# EAGLE design receiver-2x (EAGLE 7.2.0)
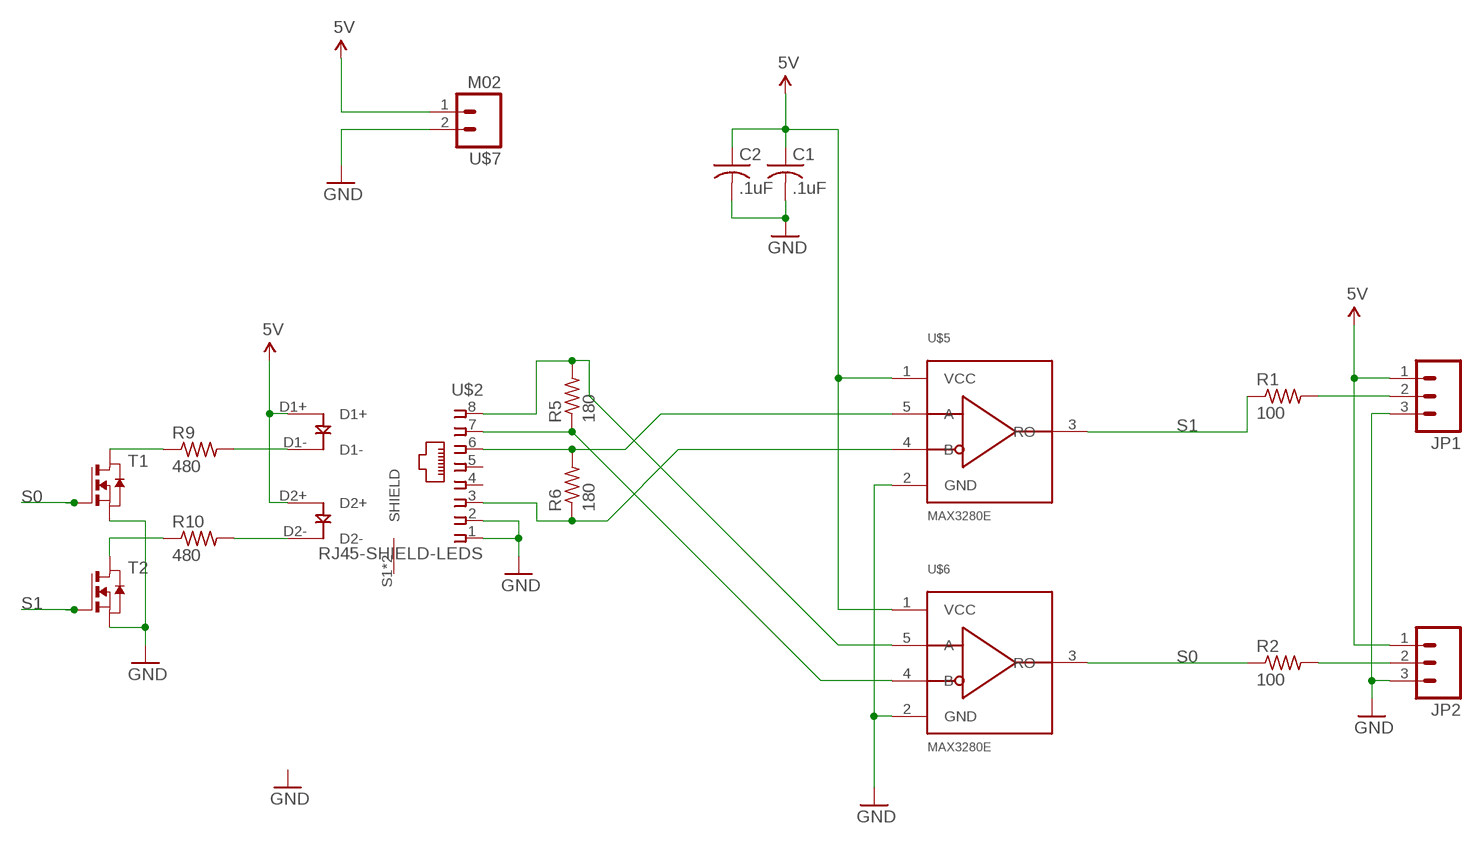
[diagram p0: schematic, sheet 1]

## Parts
C1  .1uF  C-USC0603  [C0603]
C2  .1uF  C-USC0603  [C0603]
JP1  M03SCREW-DETACH  [SCREWTERMINAL-5MM-3-DETACHABLE]
JP2  M03SCREW-DETACH  [SCREWTERMINAL-5MM-3-DETACHABLE]
R1  100  R-US_R0603  [R0603]
R2  100  R-US_R0603  [R0603]
R5  180  R-US_R0603  [R0603]
R6  180  R-US_R0603  [R0603]
R9  480  R-US_R0603  [R0603]
R10  480  R-US_R0603  [R0603]
T1  NMOSSOT23  [SOT-23]
T2  NMOSSOT23  [SOT-23]
U$2  RJ45-SHIELD-LEDS  [RJ45-SHIELD-LEDS-ALT]
U$5  MAX3280E  [SOT23-5L]
U$6  MAX3280E  [SOT23-5L]
U$7  M02  [SCREWTERMINAL-5MM-2-DETACHABLE]

## Nets
5V: C1.1 C2.1 JP1.1 JP2.1 U$2.D1+ U$2.D2+ U$5.1(VCC) U$6.1(VCC) U$7.1
GND: C1.2 C2.2 JP1.3 JP2.3 T1.2(S) T2.2(S) U$2.1 U$2.2 U$5.2(GND) U$6.2(GND) U$7.2
N$1: JP1.2 R1.2
N$4: JP2.2 R2.2
N$5: R10.2 U$2.D2-
N$6: R9.2 U$2.D1-
N$7: R10.1 T2.1(D)
N$10: R9.1 T1.1(D)
S0: R2.1 T1.3(G) U$6.3(RO)
S0_IN+: R5.2 U$2.8 U$6.5(A)
S0_IN-: R5.1 U$2.7 U$6.4(B)
S1: R1.1 T2.3(G) U$5.3(RO)
S1_IN+: R6.2 U$2.6 U$5.5(A)
S1_IN-: R6.1 U$2.3 U$5.4(B)
Unconnected: U$2.4 U$2.5 U$2.S1(SHIELD) U$2.S2(SHIELD)

## Library data of the parts
C1 C2 = adafruit:C-US: CAPACITOR, American symbol
JP1 JP2 = LEDscape:M03: Header 3 Standard 3-pin 0.1" header. Use with straight break away headers (SKU : PRT-00116), right angle break away headers (PRT-00553), swiss pins (PRT-00743), machine pins (PRT-00117), and female headers (PRT-00115). Molex polarized connector foot print use with SKU : PRT-08232 with associated crimp pins and housings.
R1 R2 R5 R6 R9 R10 = adafruit:R-US_: RESISTOR, American symbol
T1 T2 = zetex:NMOSSOT23: MOS FET; OC_FARNELL: unknown; OC_NEWARK: unknown
U$2 = LEDscape:RJ45-SHIELD-LEDS
U$5 U$6 = LEDscape:MAX3280E
U$7 = LEDscape:M02

## Board
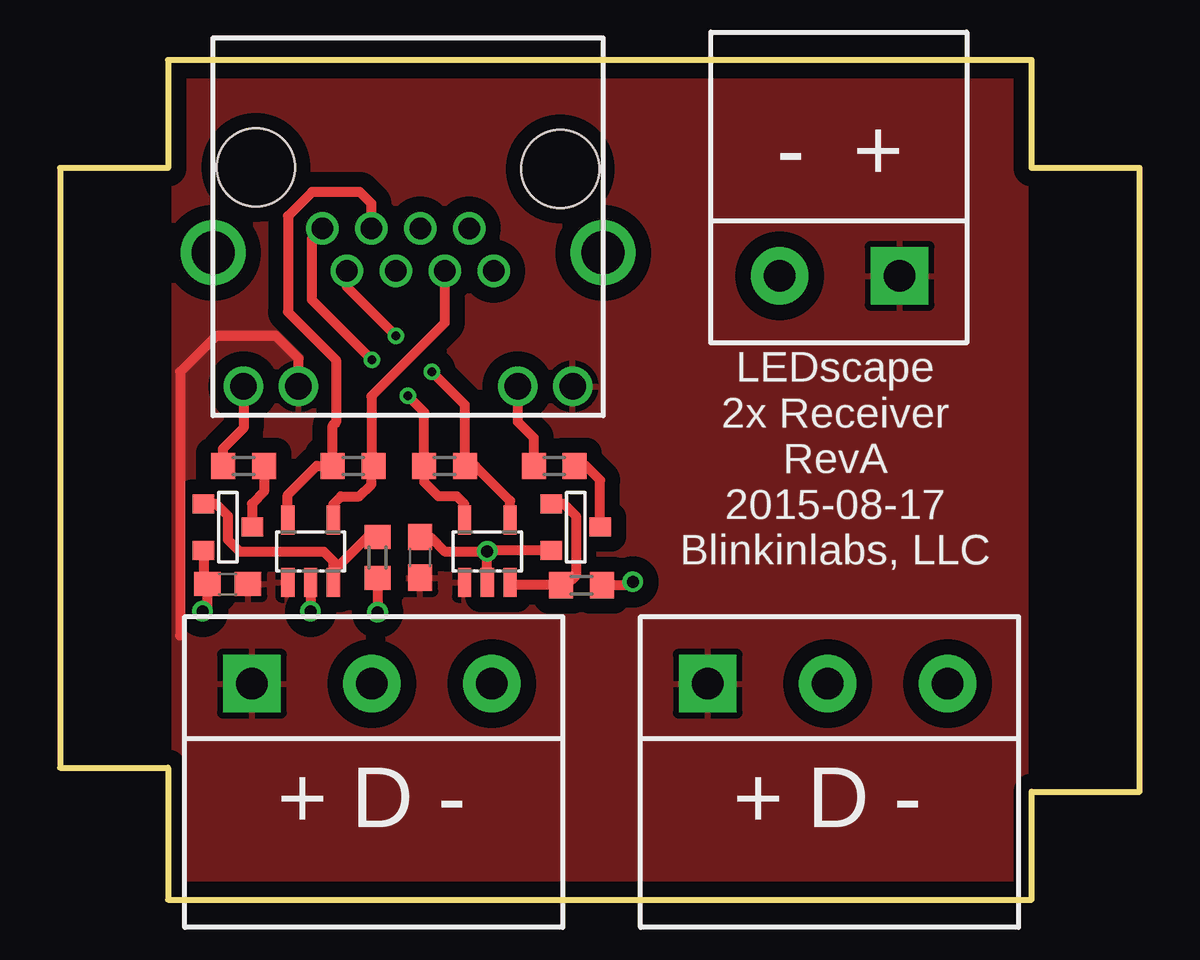
[diagram p1: board, top side]
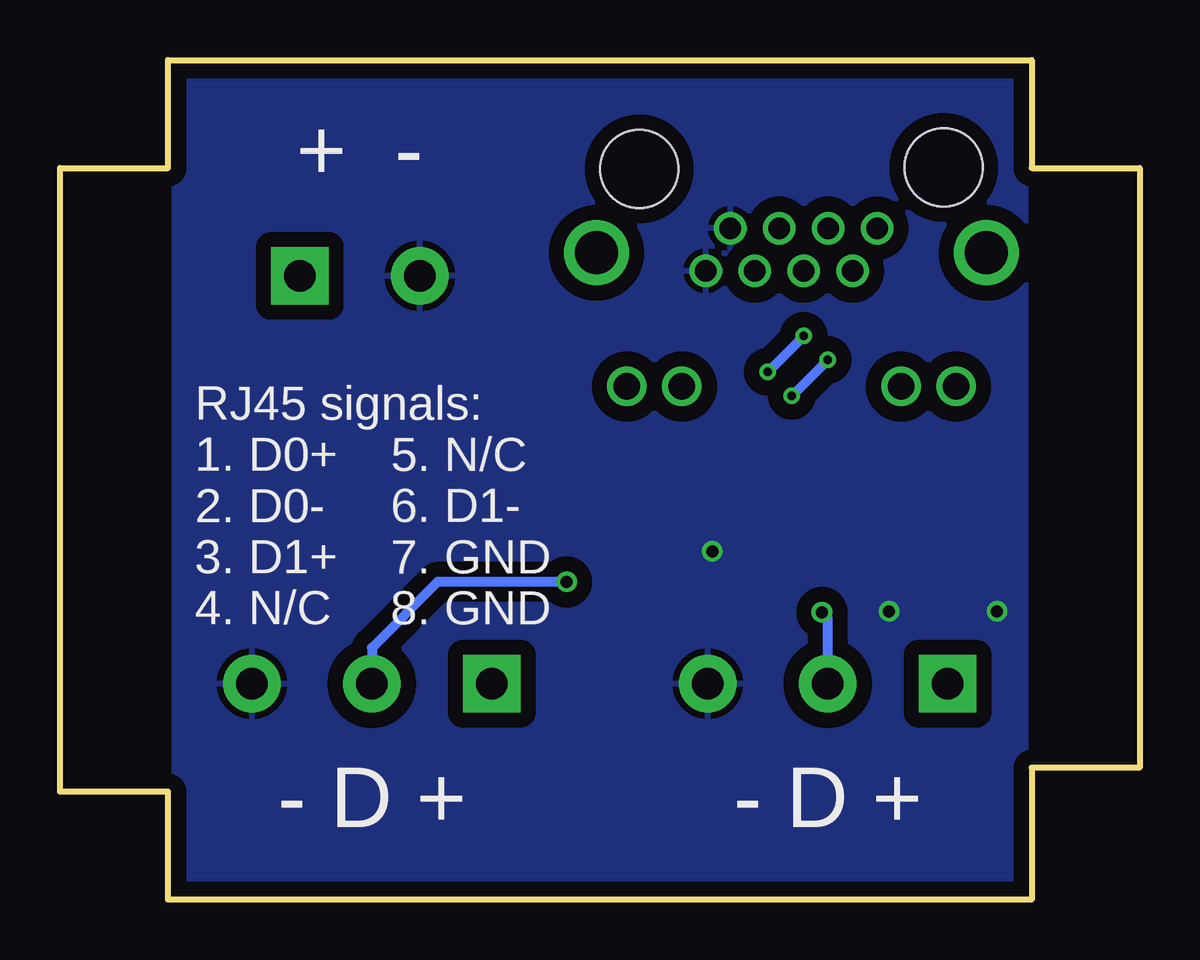
[diagram p2: board, bottom side, seen from below]

Size 45 x 35 mm. Coordinates in mm from the lower left corner, seen from the top.
Outline: 0,30.5 0,5.5 4.5,5.5 4.5,0 40.5,0 40.5,4.5 45,4.5 45,30.5 40.5,30.5 40.5,35 4.5,35 4.5,30.5 0,30.5
Copper layers (1*16): Top 0.0356mm / dielectric 1.5011mm / Bottom 0.0356mm
Design rules "LaenPCBOrder *": minimum track width 6mil, minimum drill 13mil, track to track 6mil, track to pad 6mil, pad to pad 6mil, via to via 6mil, smd to smd 6mil, copper to edge 15mil, drill to drill 6mil, minimum pad ring 7mil, minimum via ring 7mil, stop-mask expansion 4mil, vias tented up to drill 2mm, thermal gap 10mil
tRestrict: area 0,0 to 4,35; area 41,0 to 45,35
bRestrict: area 0,0 to 4,35; area 41,0 to 45,35

### Footprints (pad centres in the part's own frame; a part is rotated, then mirrored left to right if it is on the bottom)
C0603 = smd 1.1 x 1: 1 -0.85,0; 2 0.85,0
SCREWTERMINAL-5MM-3-DETACHABLE = drill 1.3 pad 2.413 square: 1 0,0 | drill 1.3 pad 2.413: 2 5,0; 3 10,0
R0603 = smd 1 x 1.1: 1 -0.85,0; 2 0.85,0
SOT-23 = smd 0.787 x 0.889: 1 0.025,-1.016; 2 -0.94,1.016; 3 0.991,1.016
RJ45-SHIELD-LEDS-ALT = drill 0.9: 1 -3.57,0.76; 2 -2.55,-1.02; 3 -1.53,0.76; 4 -0.51,-1.02; 5 0.51,0.76; 6 1.53,-1.02; 7 2.55,0.76; 8 3.57,-1.02 | drill 1.1: D1+ -6.86,5.57; D1- -4.57,5.57; D2+ 4.57,5.57; D2- 6.86,5.57 | drill 1.8: S1 -8.13,0; S2 8.13,0 | hole 3.25: -6.35,-3.5; 6.35,-3.56
SOT23-5L = smd 0.55 x 1.2: 1 -0.95,-1.3; 2 0,-1.3; 3 0.95,-1.3; 4 0.95,1.3; 5 -0.95,1.3
SCREWTERMINAL-5MM-2-DETACHABLE = drill 1.3 pad 2.413 square: 1 0,0 | drill 1.3 pad 2.413: 2 5,0

### Placement (x,y rotation side)
C1  15.02,14.26 90 top
C2  6.99,13.15 180 top
JP1  8,9 0 top
JP2  27,9 0 top
R1  13.24,14.26 270 top
R2  21.74,13.11 0 top
R5  16.03,18.07 180 top
R6  12.22,18.07 180 top
R9  20.61,18.07 180 top
R10  7.65,18.07 180 top
T1  21.5,15.5 90 top
T2  7,15.5 90 top
U$2  14.51,26.96 180 top
U$3  [DISORIENT_LOGO]  105.41,36.07 270 top  (outside the outline)
U$5  10.45,14.52 0 top
U$6  17.81,14.52 0 top
U$7  35,26 180 top

### Tracks (layer width: path | path; a pad name or v marks a point on that pad's centre or on a via)
5V
  Top 0.406: U$2.D2+ 9.94,22.56 9,23.5 6.5,23.5 5,22 5,11
  pour Top (isolate 0.635): 0,0 0,35 45,35 45,0
GND  (via drill 0.5)
  Top 0.406: C1.2 15.44,15.11 16.03,14.52 v17.81,14.52 | U$6.2 v17.81,14.52 | U$5.2 v10.45,12.02 | v5.95,12.02 6.14,12.21 C2.2 5.98,13.31 T2.2 | T1.2 17.85,14.56 v17.81,14.52
  pour Bottom (isolate 0.635): 0,0 0,35 45,35 45,0
N$1  (via drill 0.5)
  Top 0.406: R1.2 v13.24,11.98
  Bottom 0.406: JP1.2 13,11.74 v13.24,11.98
N$4  (via drill 0.5)
  Top 0.406: R2.2 23.74,13.11 v23.88,13.25
  Bottom 0.406: v23.88,13.25 29.25,13.25 32,10.5 JP2.2
N$5
  Top 0.406: U$2.D2- 7.65,19.65 6.8,18.8 R10.2
N$6
  Top 0.406: U$2.D1- 19.08,19.92 19.76,19.24 R9.2
N$7
  Top 0.406: R10.1 8.5,17 8,16.5 8,15.54 T2.1
N$10
  Top 0.406: T1.1 22.52,17.48 21.93,18.07 R9.1
S0
  Top 0.406: U$6.3 18.87,13.11 R2.1 21.11,13.11 21.5,13.5 21.5,16 21.01,16.49 T1.3
S0_IN+  (via drill 0.35)
  Top 0.406: U$6.5 16.86,16.48 16.54,16.8 15.78,16.8 15.18,17.4 R5.2 15.18,20.32 v14.5,21 | v13,22.5 10.5,25 10.5,27.54 U$2.8
  Bottom 0.406: v14.5,21 v13,22.5
S0_IN-  (via drill 0.35)
  Top 0.406: U$6.4 18.76,16.62 17.3,18.07 R5.1 16.88,20.62 v15.5,22 | U$2.7 11.96,25.54 v14,23.5
  Bottom 0.406: v14,23.5 v15.5,22
S1
  Top 0.406: R1.1 12.82,15.11 11.4,13.69 | U$5.3 11.4,13.69 | 11.4,13.69 11.4,14.1 11,14.5 7.5,14.5 7,15 7,16 6.51,16.49 T2.3
S1_IN+
  Top 0.406: U$5.5 9.5,16.87 10.7,18.07 R6.2 11.37,19.76 11.5,19.89 11.5,22.5 9.5,24.5 9.5,28.5 10.5,29.5 12.5,29.5 12.98,29.02 U$2.6
S1_IN-
  Top 0.254: 12.99,18.16 R6.1
  Top 0.406: 12.99,18.16 12.99,20.99 16.04,24.04 U$2.3 | U$5.4 11.4,16.48 11.72,16.8 12.48,16.8 12.99,17.31 12.99,17.99 R6.1

### Text on the board
tNames: + - | LEDscape / 2x Receiver / RevA / 2015-08-17 / Blinkinlabs, LLC | + D - | + D -
bNames: - + | 5. N/C / 6. D1- / 7. GND / 8. GND | RJ45 signals: / 1. D0+ / 2. D0- / 3. D1+ / 4. N/C | - D + | - D +